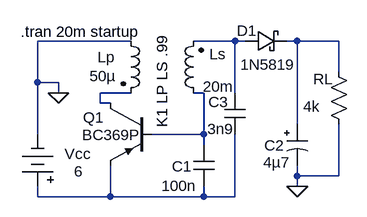
[diagram p0: schematic Conv6v_High.asc]
Conv6v_High.asc, the LTspice schematic file:
Version 4
SHEET 1 880 680
WIRE 48 96 -96 96
WIRE 208 96 144 96
WIRE 224 96 208 96
WIRE 304 96 288 96
WIRE 368 96 304 96
WIRE 368 144 368 96
WIRE -96 160 -96 96
WIRE -64 160 -96 160
WIRE -64 176 -64 160
WIRE 48 176 0 176
WIRE 160 176 144 176
WIRE 208 176 208 96
WIRE 0 192 0 176
WIRE 16 192 0 192
WIRE 304 224 304 96
WIRE -96 240 -96 160
WIRE 160 240 160 176
WIRE 160 240 80 240
WIRE 160 256 160 240
WIRE 304 304 304 288
WIRE 368 304 368 224
WIRE 368 304 304 304
WIRE 304 320 304 304
WIRE -96 336 -96 320
WIRE 16 336 16 288
WIRE 16 336 -96 336
WIRE 160 336 160 320
WIRE 160 336 16 336
WIRE 208 336 208 240
WIRE 208 336 160 336
FLAG -64 176 0
FLAG 304 320 0
SYMBOL Misc\\battery -96 336 R180
WINDOW 0 -81 66 Left 0
WINDOW 3 -70 39 Left 0
WINDOW 123 0 0 Left 0
SYMATTR InstName Vcc
SYMATTR Value 6
SYMATTR SpiceLine Rser=10m Cpar=10u
SYMBOL pnp2 80 192 M0
WINDOW 0 74 22 Left 0
WINDOW 3 18 49 Left 0
SYMATTR InstName Q1
SYMATTR Value BC369P
SYMBOL cap 144 256 R0
WINDOW 0 -33 33 Left 0
WINDOW 3 -49 63 Left 0
SYMATTR InstName C1
SYMATTR Value 100n
SYMBOL Miscel\\ind2 32 80 R0
WINDOW 0 -36 41 Left 0
WINDOW 3 -48 70 Left 0
SYMATTR InstName Lp
SYMATTR Value 50µ
SYMBOL Miscel\\ind2 160 192 R180
WINDOW 0 -34 76 Left 0
WINDOW 3 -46 26 Left 0
SYMATTR InstName Ls
SYMATTR Value 20m
SYMBOL schottky 224 112 R270
WINDOW 0 16 2 VTop 0
WINDOW 3 -5 35 VBottom 0
SYMATTR InstName D1
SYMATTR Value 1N5819
SYMATTR Description Diode
SYMATTR Type diode
SYMBOL polcap 288 224 R0
WINDOW 0 -35 33 Left 0
WINDOW 3 -36 59 Left 0
SYMATTR InstName C2
SYMATTR Value 4µ7
SYMATTR Description Capacitor
SYMATTR Type cap
SYMATTR SpiceLine V=63 Irms=170m Rser=1 MTBF=5000 Lser=0 mfg="Nichicon" pn="UPG1J4R7MPH" type="Al electrolytic" ppPkg=1
SYMBOL cap 224 176 M0
WINDOW 0 26 14 Left 0
WINDOW 3 18 56 Left 0
SYMATTR InstName C3
SYMATTR Value 3n9
SYMBOL res 352 128 R0
WINDOW 0 -23 27 Left 0
WINDOW 3 -39 69 Left 0
SYMATTR InstName RL
SYMATTR Value 4k
TEXT 96 88 VRight 0 !K1 LP LS .99
TEXT -122 82 Left 0 !.tran 20m startup

The netlist it stands for:
* Conv6v_High.asc
Vcc N005 0 6 Rser=10m Cpar=10u
Q1 N003 N004 N005 0 BC369P
C1 N004 N005 100n
Lp 0 N003 50µ
Ls N004 N001 20m
D1 N001 N002 1N5819
C2 N002 0 4µ7 V=63 Irms=170m Rser=1 MTBF=5000 Lser=0 mfg="Nichicon" pn="UPG1J4R7MPH" type="Al electrolytic" ppPkg=1
C3 N001 N005 3n9
RL N002 0 4k
.model D D
.lib standard.dio
.model NPN NPN
.model PNP PNP
.lib standard.bjt
K1 LP LS .99
.tran 20m startup
.backanno
.end